# EAGLE design ivo_B_v1_1 (EAGLE 9.6.2)

## Sheet 1 of 4: Audio I/O
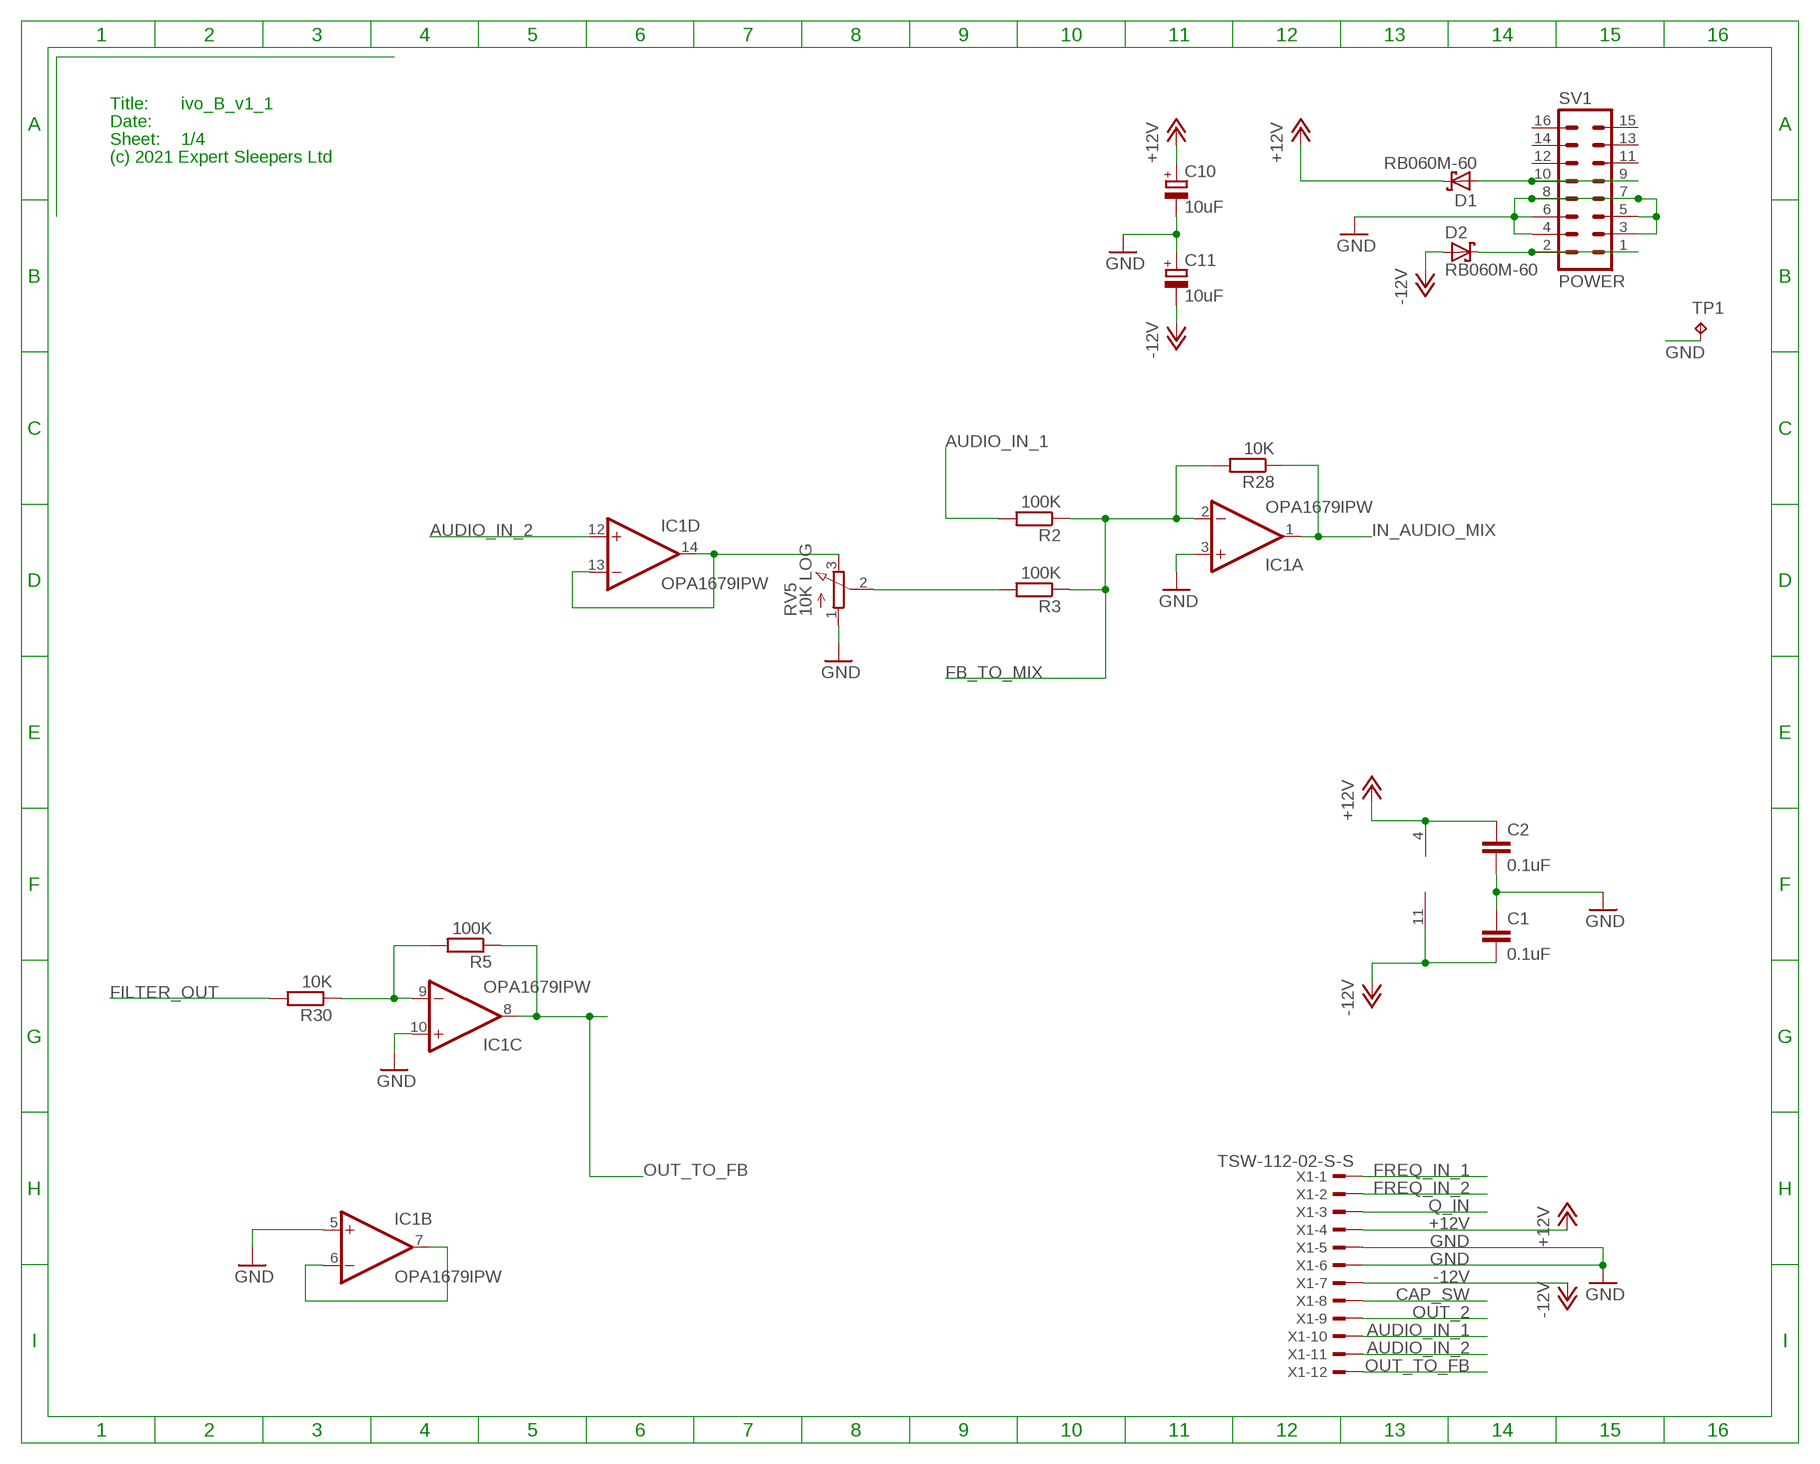
[diagram p0: schematic, sheet 1]

### Parts
C1  0.1uF  C-EUC0402  [C0402]
C2  0.1uF  C-EUC0402  [C0402]
C10  10uF  CPOL-EUUD-4X5,8  [UD-4X5,8_NICHICON]
C11  10uF  CPOL-EUUD-4X5,8  [UD-4X5,8_NICHICON]
D1  RB060M-60  [SOD123FL]
D2  RB060M-60  [SOD123FL]
IC1  OPA1679IPW  TL074PW  [PW_R-PDSO-G14]
R2  100K  R-EU_R0603  [R0603]
R3  100K  R-EU_R0603  [R0603]
R5  100K  R-EU_R0603  [R0603]
R28  10K  R-EU_R0603  [R0603]
R30  10K  R-EU_R0603  [R0603]
RV5  10K LOG  RD1610NOA0X  [RD1610NOA0X]
SV1  POWER  ML16  [ML16]
TP1  RA2  TPPAD1-13  [P1-13]
X1  TSW-112-02-S-S  [TSW-112-02-S-S]

### Nets
+12V: C2.1 C10.+ D1.C IC1.4(P:V+) X1.4 ; also sheet 2,3,4
-12V: C1.2 C11.- D2.A IC1.11(P:V-) X1.7 ; also sheet 2,3,4
AUDIO_IN_1: R2.2 X1.10
AUDIO_IN_2: IC1.12(D:+IN) X1.11
CAP_SW: X1.8 ; also sheet 4
FB_TO_MIX: IC1.2(A:-IN) R2.1 R3.1 R28.2 ; also sheet 2
FILTER_OUT: R30.2 ; also sheet 4
FREQ_IN_1: X1.1 ; also sheet 3
FREQ_IN_2: X1.2 ; also sheet 3
GND [power]: C1.1 C2.2 C10.- C11.+ IC1.3(A:+IN) IC1.5(B:+IN) IC1.10(C:+IN) RV5.1(A) SV1.3 SV1.4 SV1.5 SV1.6 SV1.7 SV1.8 TP1.TP X1.5 X1.6 ; also sheet 2,3,4
IN_AUDIO_MIX: IC1.1(A:OUT) R28.1 ; also sheet 4
N$1: D2.C SV1.1 SV1.2
N$3: IC1.6(B:-IN) IC1.7(B:OUT)
N$5: IC1.9(C:-IN) R5.2 R30.1
N$7: IC1.13(D:-IN) IC1.14(D:OUT) RV5.3(E)
N$10: R3.2 RV5.2(S)
N$15: D1.A SV1.9 SV1.10
OUT_2: X1.9 ; also sheet 4
OUT_TO_FB: IC1.8(C:OUT) R5.1 X1.12 ; also sheet 2
Q_IN: X1.3 ; also sheet 2
Unconnected: SV1.11 SV1.12 SV1.13 SV1.14 SV1.15 SV1.16

### Notes on the sheet
- Title:
- Date:
- Sheet:
- (c) 2021 Expert Sleepers Ltd

## Sheet 2 of 4: Feedback
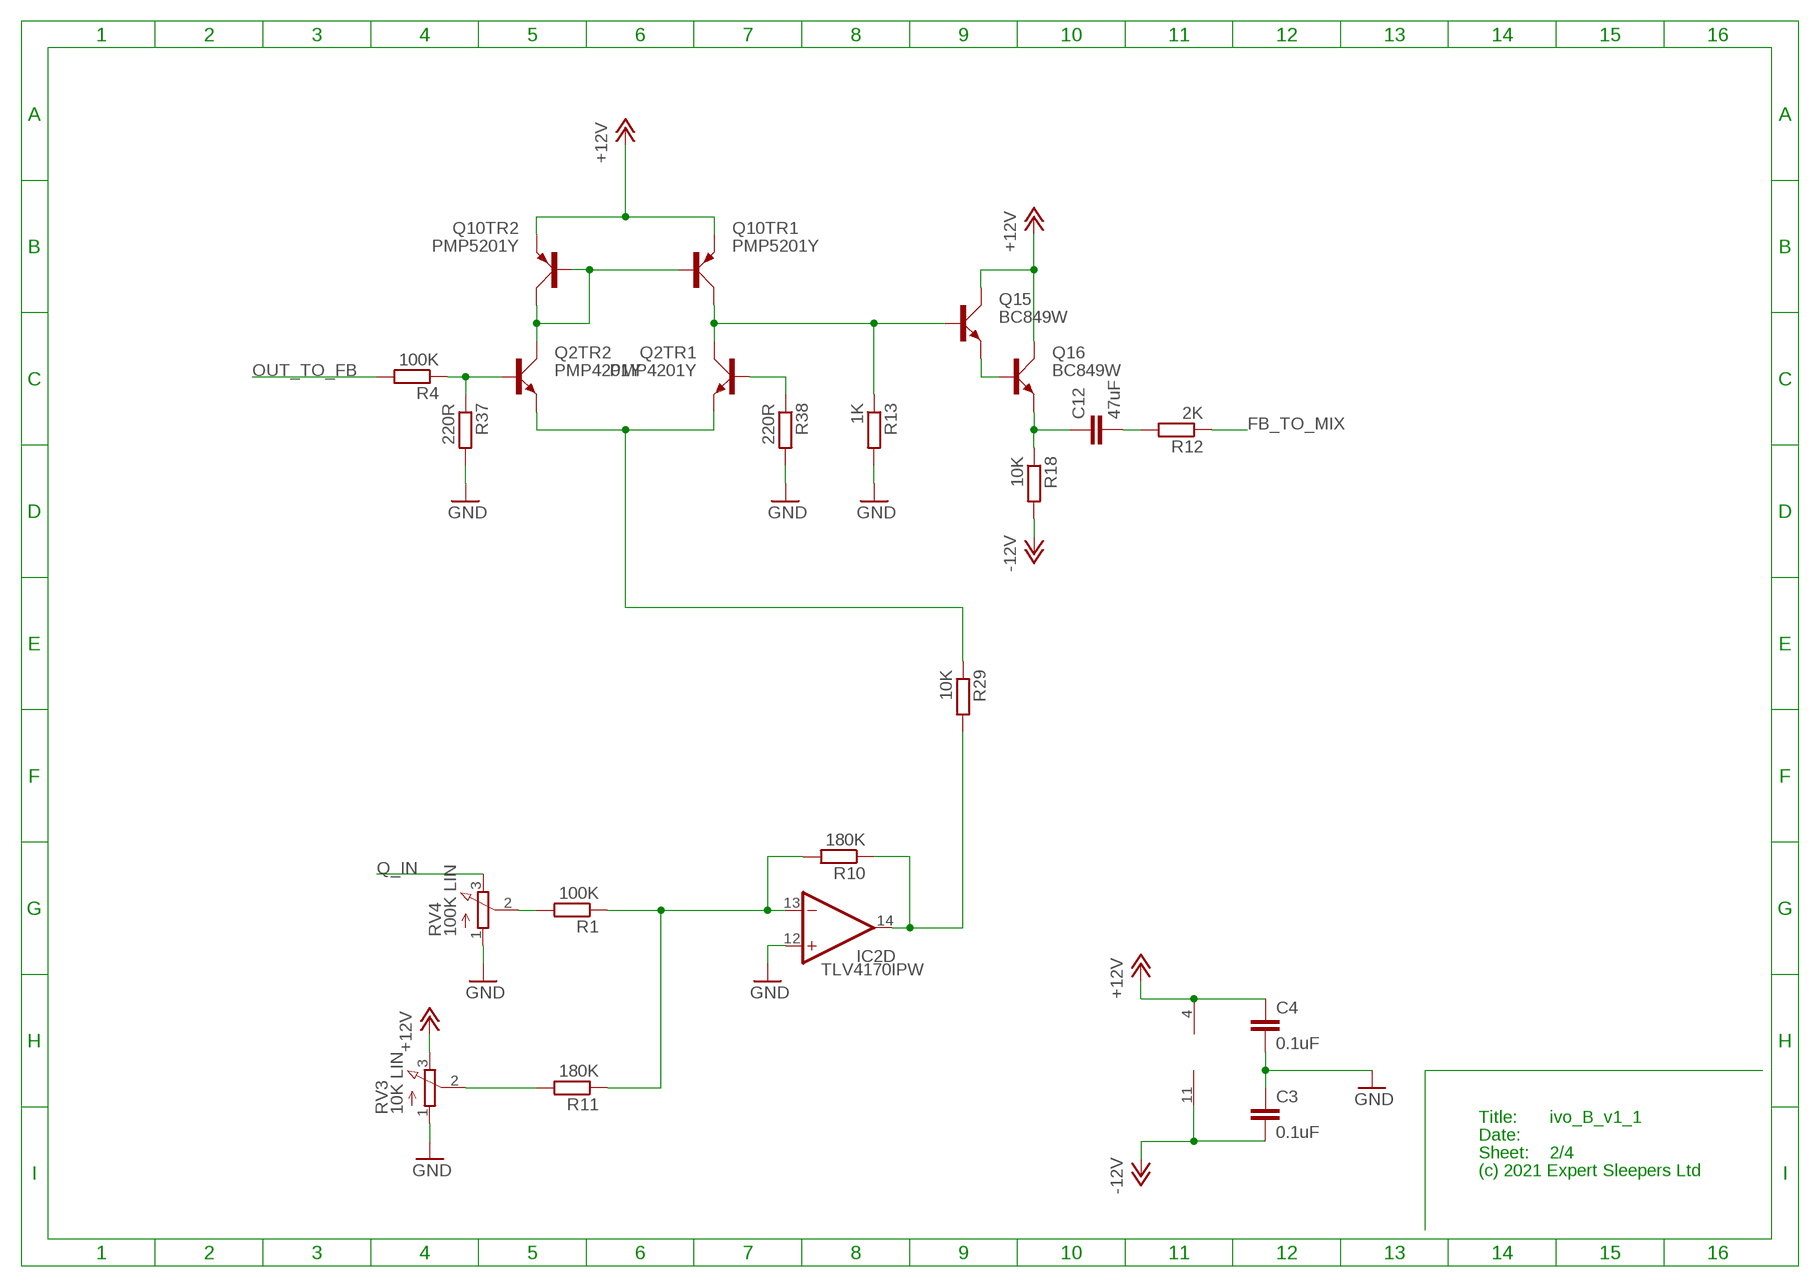
[diagram p1: schematic, sheet 2]

### Parts
C3  0.1uF  C-EUC0402  [C0402]
C4  0.1uF  C-EUC0402  [C0402]
C12  47uF  C-EUC1206  [C1206]
IC2  TLV4170IPW  TL074PW  [PW_R-PDSO-G14]
Q2  PMP4201Y  [SOT65P210X110-6N]
Q10  PMP5201Y  [SOT65P210X110-6N]
Q15  BC849W  [SOT323]
Q16  BC849W  [SOT323]
R1  100K  R-EU_R0603  [R0603]
R4  100K  R-EU_R0603  [R0603]
R10  180K  R-EU_R0603  [R0603]
R11  180K  R-EU_R0603  [R0603]
R12  2K  R-EU_R0603  [R0603]
R13  1K  R-EU_R0603  [R0603]
R18  10K  R-EU_R0603  [R0603]
R29  10K  R-EU_R0603  [R0603]
R37  220R  R-EU_R0603  [R0603]
R38  220R  R-EU_R0603  [R0603]
RV3  10K LIN  RD1610NOA0X  [RD1610NOA0X]
RV4  100K LIN  RD1610NOA0X  [RD1610NOA0X]

### Nets
+12V: C4.1 IC2.4(P:V+) Q10.4(TR2:E) Q10.5(TR1:E) Q15.3(C) Q16.3(C) RV3.3(E) ; also sheet 1,3,4
-12V: C3.2 IC2.11(P:V-) R18.2 ; also sheet 1,3,4
FB_TO_MIX: R12.1 ; also sheet 1
GND [power]: C3.1 C4.2 IC2.12(D:+IN) R13.2 R37.2 R38.2 RV3.1(A) RV4.1(A) ; also sheet 1,3,4
N$9: R1.2 RV4.2(S)
N$12: R11.2 RV3.2(S)
N$14: IC2.13(D:-IN) R1.1 R10.2 R11.1
N$18: IC2.14(D:OUT) R10.1 R29.2
N$21: C12.2 R12.2
N$24: Q2.2(TR2:B) R4.1 R37.1
N$26: Q2.4(TR2:E) Q2.5(TR1:E) R29.1
N$27: C12.1 Q16.2(E) R18.1
N$28: Q2.3(TR2:C) Q10.1(TR1:B) Q10.2(TR2:B) Q10.3(TR2:C)
N$31: Q2.6(TR1:C) Q10.6(TR1:C) Q15.1(B) R13.1
N$32: Q2.1(TR1:B) R38.1
N$34: Q15.2(E) Q16.1(B)
OUT_TO_FB: R4.2 ; also sheet 1
Q_IN: RV4.3(E) ; also sheet 1

### Notes on the sheet
- Title:
- Date:
- Sheet:
- (c) 2021 Expert Sleepers Ltd

## Sheet 3 of 4: Frequency control
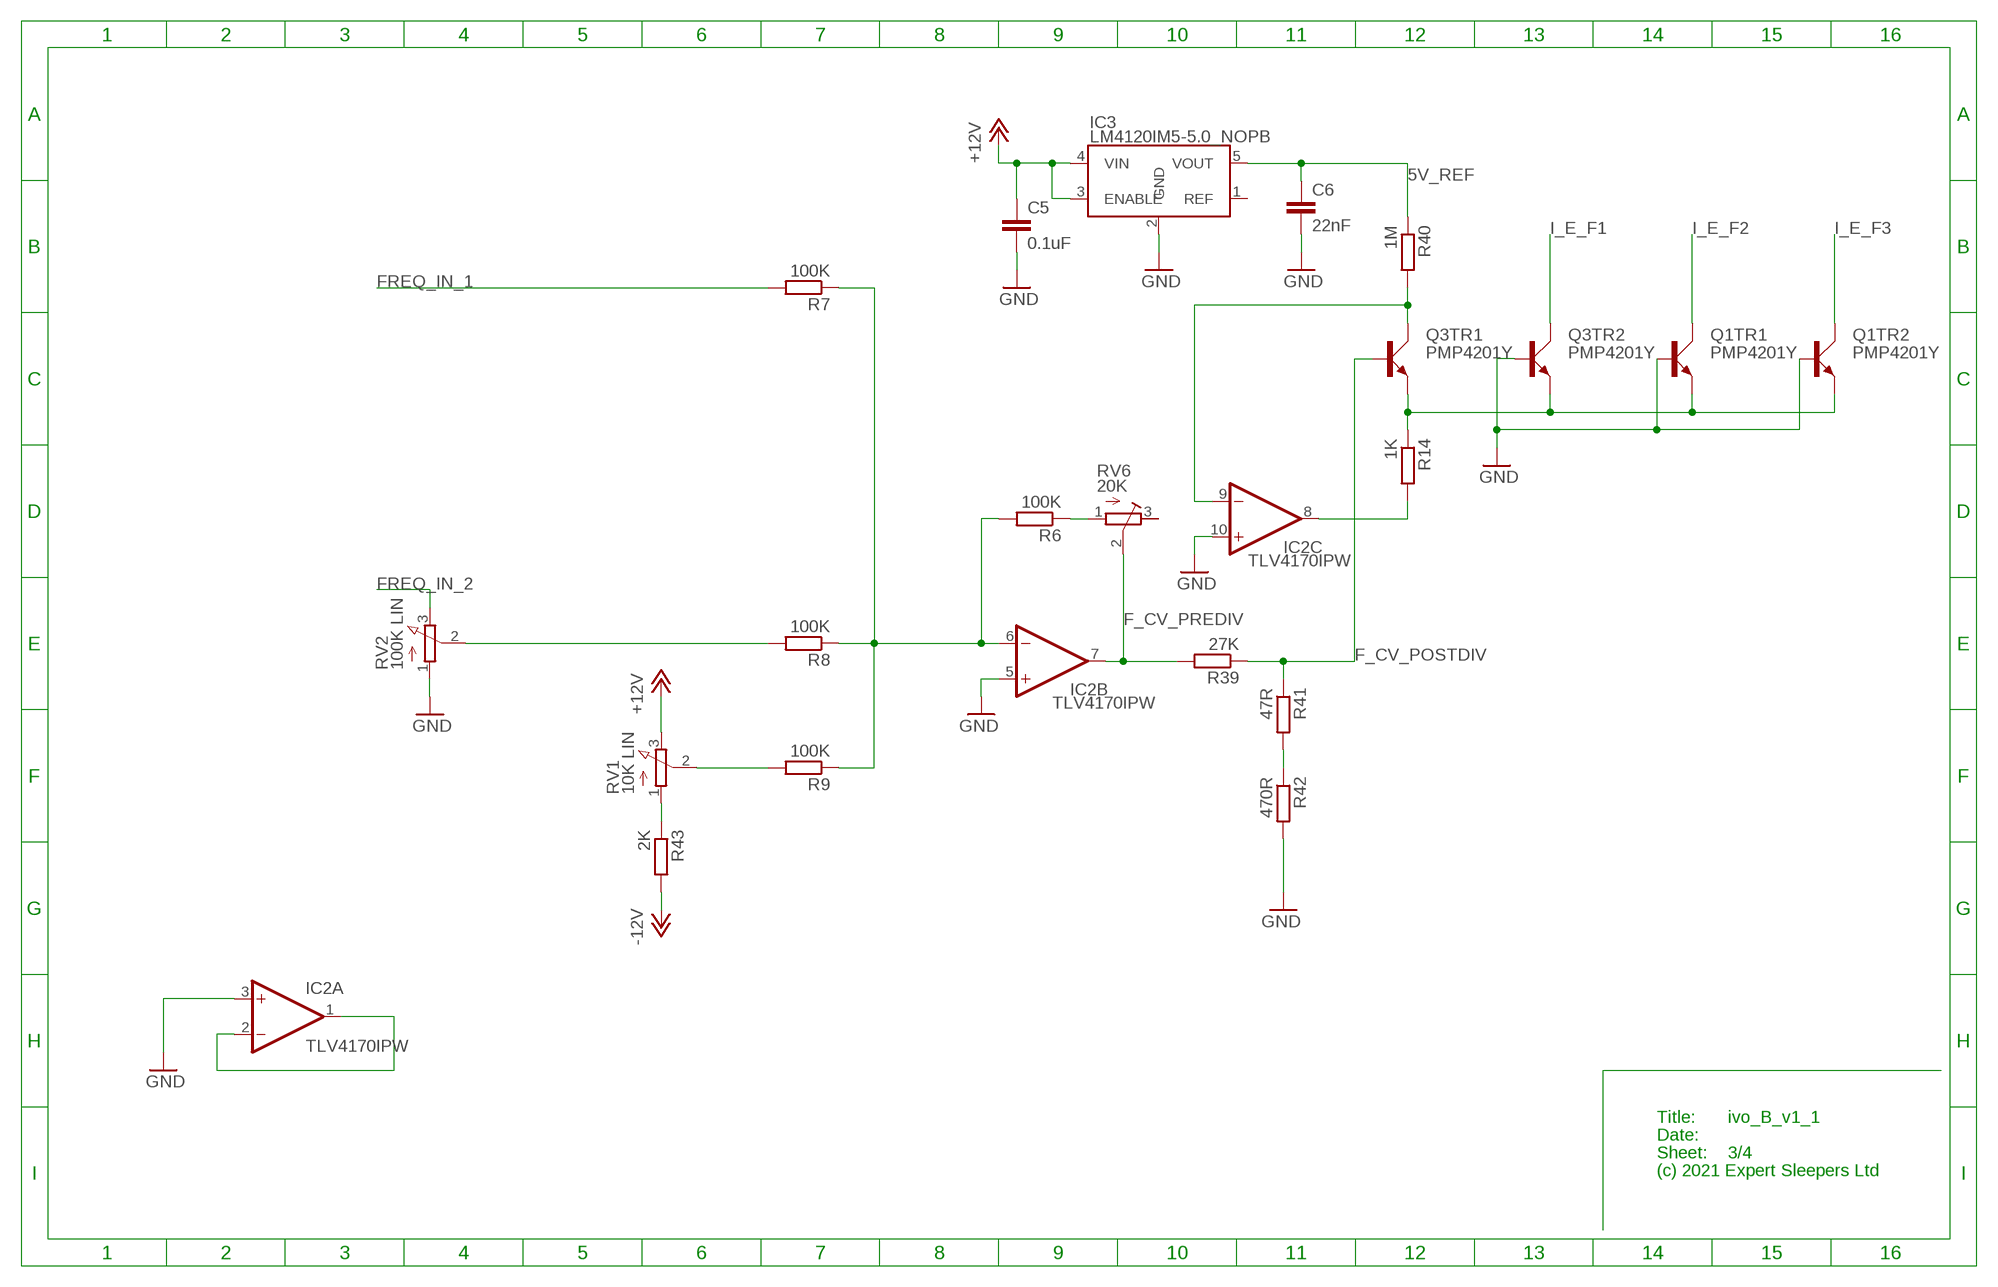
[diagram p2: schematic, sheet 3]

### Parts
C5  0.1uF  C-EUC0402  [C0402]
C6  22nF  C-EUC0402  [C0402]
IC3  LM4120IM5-5.0_NOPB  [SOT95P280X145-5N]
Q1  PMP4201Y  [SOT65P210X110-6N]
Q3  PMP4201Y  [SOT65P210X110-6N]
R6  100K  R-EU_R0603  [R0603]
R7  100K  R-EU_R0603  [R0603]
R8  100K  R-EU_R0603  [R0603]
R9  100K  R-EU_R0603  [R0603]
R14  1K  R-EU_R0603  [R0603]
R39  27K  R-EU_R0603  [R0603]
R40  1M  R-EU_R0603  [R0603]
R41  47R  R-EU_R0603  [R0603]
R42  470R  R-EU_R1206  [R1206]
R43  2K  R-EU_R0603  [R0603]
RV1  10K LIN  RD1610NOA0X  [RD1610NOA0X]
RV2  100K LIN  RD1610NOA0X  [RD1610NOA0X]
RV6  20K  TC33X  [TC33X]

### Nets
5V_REF: C6.1 IC3.5(VOUT) R40.1
+12V: C5.1 IC3.3(ENABLE) IC3.4(VIN) RV1.3(E) ; also sheet 1,2,4
-12V: R43.2 ; also sheet 1,2,4
F_CV_POSTDIV: Q3.1(TR1:B) R39.1 R41.1
F_CV_PREDIV: IC2.7(B:OUT) R39.2 RV6.2(S)
FREQ_IN_1: R7.2 ; also sheet 1
FREQ_IN_2: RV2.3(E) ; also sheet 1
GND [power]: C5.2 C6.2 IC2.3(A:+IN) IC2.5(B:+IN) IC2.10(C:+IN) IC3.2(GND) Q1.1(TR1:B) Q1.2(TR2:B) Q3.2(TR2:B) R42.2 RV2.1(A) ; also sheet 1,2,4
I_E_F1: Q3.3(TR2:C) ; also sheet 4
I_E_F2: Q1.6(TR1:C) ; also sheet 4
I_E_F3: Q1.3(TR2:C) ; also sheet 4
N$2: R43.1 RV1.1(A)
N$4: R6.1 RV6.1(A)
N$13: IC2.6(B:-IN) R6.2 R7.1 R8.1 R9.1
N$23: IC2.1(A:OUT) IC2.2(A:-IN)
N$36: R8.2 RV2.2(S)
N$37: R9.2 RV1.2(S)
N$38: R41.2 R42.1
N$45: Q1.4(TR2:E) Q1.5(TR1:E) Q3.4(TR2:E) Q3.5(TR1:E) R14.1
N$46: IC2.9(C:-IN) Q3.6(TR1:C) R40.2
N$48: IC2.8(C:OUT) R14.2
Unconnected: IC3.1(REF) RV6.3(E)

### Notes on the sheet
- Title:
- Date:
- Sheet:
- (c) 2021 Expert Sleepers Ltd

## Sheet 4 of 4: Filter core
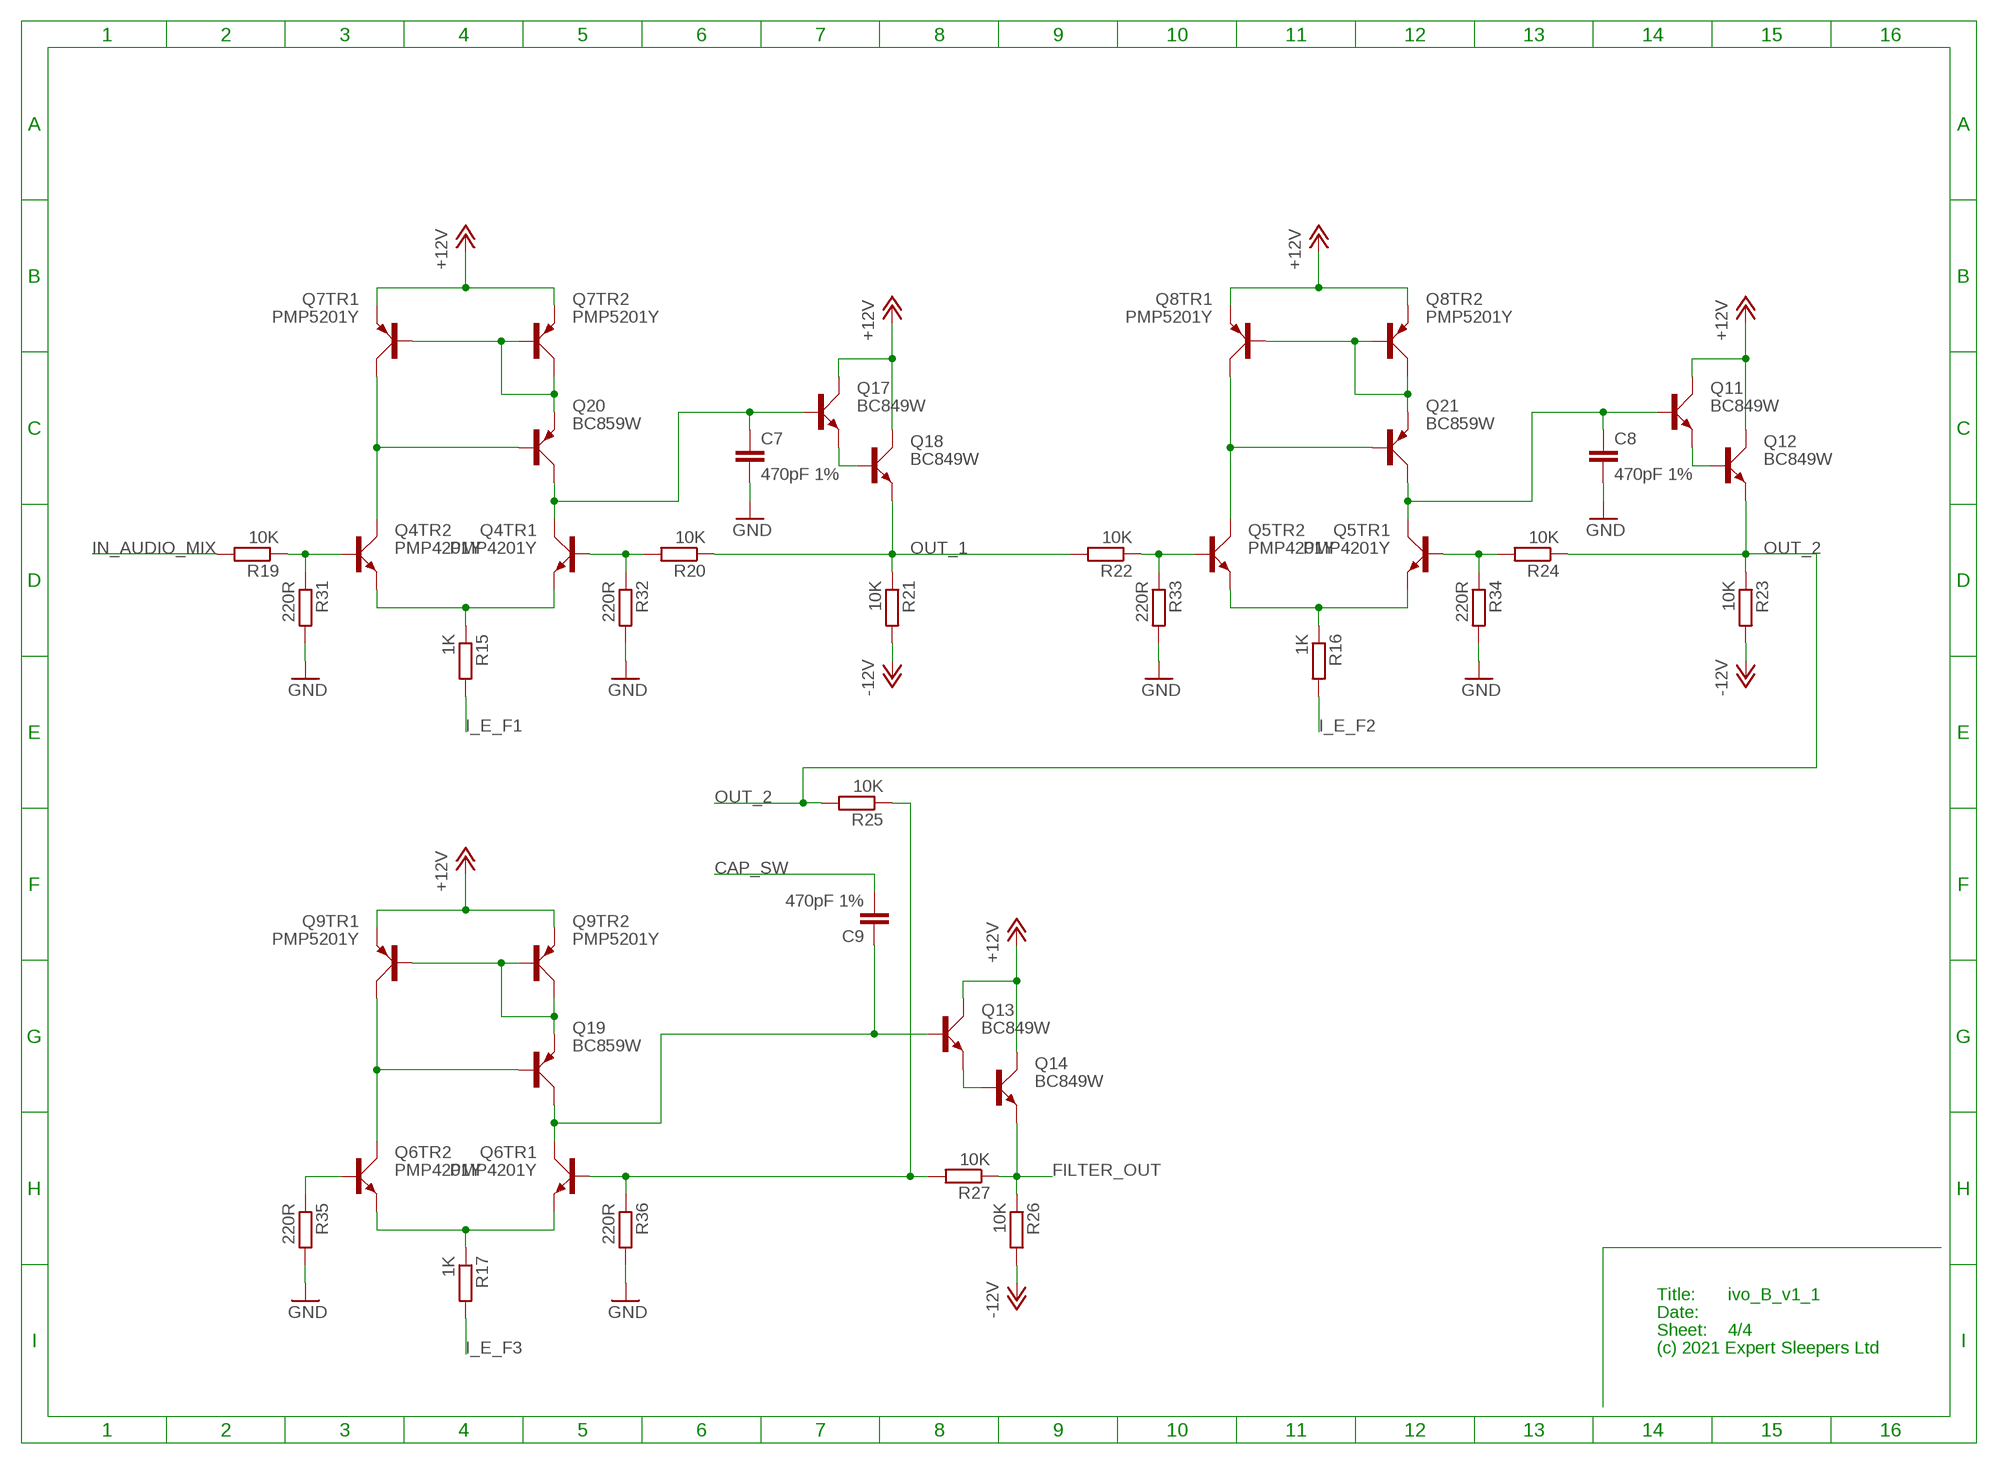
[diagram p3: schematic, sheet 4]

### Parts
C7  470pF 1%  C-EUC0603  [C0603]
C8  470pF 1%  C-EUC0603  [C0603]
C9  470pF 1%  C-EUC0603  [C0603]
Q4  PMP4201Y  [SOT65P210X110-6N]
Q5  PMP4201Y  [SOT65P210X110-6N]
Q6  PMP4201Y  [SOT65P210X110-6N]
Q7  PMP5201Y  [SOT65P210X110-6N]
Q8  PMP5201Y  [SOT65P210X110-6N]
Q9  PMP5201Y  [SOT65P210X110-6N]
Q11  BC849W  [SOT323]
Q12  BC849W  [SOT323]
Q13  BC849W  [SOT323]
Q14  BC849W  [SOT323]
Q17  BC849W  [SOT323]
Q18  BC849W  [SOT323]
Q19  BC859W  [SOT323]
Q20  BC859W  [SOT323]
Q21  BC859W  [SOT323]
R15  1K  R-EU_R0603  [R0603]
R16  1K  R-EU_R0603  [R0603]
R17  1K  R-EU_R0603  [R0603]
R19  10K  R-EU_R0603  [R0603]
R20  10K  R-EU_R0603  [R0603]
R21  10K  R-EU_R0603  [R0603]
R22  10K  R-EU_R0603  [R0603]
R23  10K  R-EU_R0603  [R0603]
R24  10K  R-EU_R0603  [R0603]
R25  10K  R-EU_R0603  [R0603]
R26  10K  R-EU_R0603  [R0603]
R27  10K  R-EU_R0603  [R0603]
R31  220R  R-EU_R0603  [R0603]
R32  220R  R-EU_R0603  [R0603]
R33  220R  R-EU_R0603  [R0603]
R34  220R  R-EU_R0603  [R0603]
R35  220R  R-EU_R0603  [R0603]
R36  220R  R-EU_R0603  [R0603]

### Nets
+12V: Q7.4(TR2:E) Q7.5(TR1:E) Q8.4(TR2:E) Q8.5(TR1:E) Q9.4(TR2:E) Q9.5(TR1:E) Q11.3(C) Q12.3(C) Q13.3(C) Q14.3(C) Q17.3(C) Q18.3(C) ; also sheet 1,2,3
-12V: R21.2 R23.2 R26.2 ; also sheet 1,2,3
CAP_SW: C9.2 ; also sheet 1
FILTER_OUT: Q14.2(E) R26.1 R27.1 ; also sheet 1
GND [power]: C7.2 C8.2 R31.2 R32.2 R33.2 R34.2 R35.2 R36.2 ; also sheet 1,2,3
I_E_F1: R15.2 ; also sheet 3
I_E_F2: R16.2 ; also sheet 3
I_E_F3: R17.2 ; also sheet 3
IN_AUDIO_MIX: R19.2 ; also sheet 1
N$20: Q4.2(TR2:B) R19.1 R31.1
N$39: Q4.4(TR2:E) Q4.5(TR1:E) R15.1
N$53: C7.1 Q4.6(TR1:C) Q17.1(B) Q20.3(C)
N$54: Q4.3(TR2:C) Q7.6(TR1:C) Q20.1(B)
N$55: Q4.1(TR1:B) R20.2 R32.1
N$56: Q17.2(E) Q18.1(B)
N$57: Q7.1(TR1:B) Q7.2(TR2:B) Q7.3(TR2:C) Q20.2(E)
N$59: Q5.2(TR2:B) R22.1 R33.1
N$60: Q5.4(TR2:E) Q5.5(TR1:E) R16.1
N$64: C8.1 Q5.6(TR1:C) Q11.1(B) Q21.3(C)
N$67: Q5.1(TR1:B) R24.2 R34.1
N$70: Q11.2(E) Q12.1(B)
N$77: Q5.3(TR2:C) Q8.6(TR1:C) Q21.1(B)
N$78: Q8.1(TR1:B) Q8.2(TR2:B) Q8.3(TR2:C) Q21.2(E)
N$79: Q6.2(TR2:B) R35.1
N$80: Q6.4(TR2:E) Q6.5(TR1:E) R17.1
N$82: C9.1 Q6.6(TR1:C) Q13.1(B) Q19.3(C)
N$83: Q6.1(TR1:B) R25.1 R27.2 R36.1
N$84: Q13.2(E) Q14.1(B)
N$85: Q6.3(TR2:C) Q9.6(TR1:C) Q19.1(B)
N$86: Q9.1(TR1:B) Q9.2(TR2:B) Q9.3(TR2:C) Q19.2(E)
OUT_1: Q18.2(E) R20.1 R21.1 R22.2
OUT_2: Q12.2(E) R23.1 R24.1 R25.2 ; also sheet 1

### Notes on the sheet
- Title:
- Date:
- Sheet:
- (c) 2021 Expert Sleepers Ltd

## Library data of the parts
C1-C9 C12 = rcl:C-EU: CAPACITOR, European symbol
C10 C11 = rcl:CPOL-EU: POLARIZED CAPACITOR, European symbol
D1 D2 = rohm2:RB060M-60: Schottky Barrier Diode
IC1 IC2 = digital-audio:TL074: OP AMP
IC3 = SamacSys_Parts:LM4120IM5-5.0_NOPB: 0.2% 50ppm/C Drift Precision Series Voltage Reference with Shutdown Enable Source: Datasheet; ARROW_PART_NUMBER: LM4120IM5-5.0/NOPB; ARROW_PRICE-STOCK: https://www.arrow.com/en/products/lm4120im5-5.0nopb/texas-instruments; DESCRIPTION: 0.2% 50ppm/C Drift Precision Series Voltage Reference with Shutdown Enable; HEIGHT: 1.45mm; MANUFACTURER_NAME: Texas Instruments; MANUFACTURER_PART_NUMBER: LM4120IM5-5.0/NOPB; MOUSER_PART_NUMBER: 926-LM4120IM550NOPB; MOUSER_PRICE-STOCK: https://www.mouser.co.uk/ProductDetail/Texas-Instruments/LM4120IM5-50-NOPB?qs=QbsRYf82W3GnvXCg2jf3mg%3D%3D
Q1-Q6 = SamacSys_Parts:PMP4201Y: Bipolar Transistors - BJT MATCHED PAIR Source: Datasheet; ARROW_PART_NUMBER: PMP4201Y,135; ARROW_PRICE-STOCK: https://www.arrow.com/en/products/pmp4201y135/nexperia; DESCRIPTION: Bipolar Transistors - BJT MATCHED PAIR; HEIGHT: 1.1mm; MANUFACTURER_NAME: Nexperia; MANUFACTURER_PART_NUMBER: PMP4201Y,135; MOUSER_PART_NUMBER: 771-PMP4201Y135; MOUSER_PRICE-STOCK: https://www.mouser.co.uk/ProductDetail/Nexperia/PMP4201Y135?qs=LOCUfHb8d9uqwNS3d98RHQ%3D%3D
Q7-Q10 = SamacSys_Parts:PMP5201Y: Bipolar Transistors - BJT MATCHED PAIR Source: Datasheet; ARROW_PART_NUMBER: PMP5201Y,135; ARROW_PRICE-STOCK: https://www.arrow.com/en/products/pmp5201y135/nexperia; DESCRIPTION: Bipolar Transistors - BJT MATCHED PAIR; HEIGHT: 1.1mm; MANUFACTURER_NAME: Nexperia; MANUFACTURER_PART_NUMBER: PMP5201Y,135; MOUSER_PART_NUMBER: 771-PMP5201Y135; MOUSER_PRICE-STOCK: https://www.mouser.co.uk/ProductDetail/Nexperia/PMP5201Y135?qs=LOCUfHb8d9vvvsx1DGNhtA%3D%3D
Q11-Q18 = NXP:BC849W
Q19-Q21 = NXP:BC859W
R1-R43 = rcl:R-EU_: RESISTOR, European symbol
RV1-RV5 = soundwell:RD1610NOA0X: 16mm Potentiometer one level Source: http://www.alphapotentiometers.net/html/16mm_pot_2.html
RV6 = bourns:TC33X
SV1 = digital-audio:ML16: MULTICOMP - MC9A12-1634
TP1 = testpad:TP: Test pad
X1 = con-samtec:TSW-112-02-S-S: THROUGH-HOLE .025" SQ POST HEADER Source: Samtec TSW.pdf; OC_FARNELL: unknown; OC_NEWARK: unknown

## Board
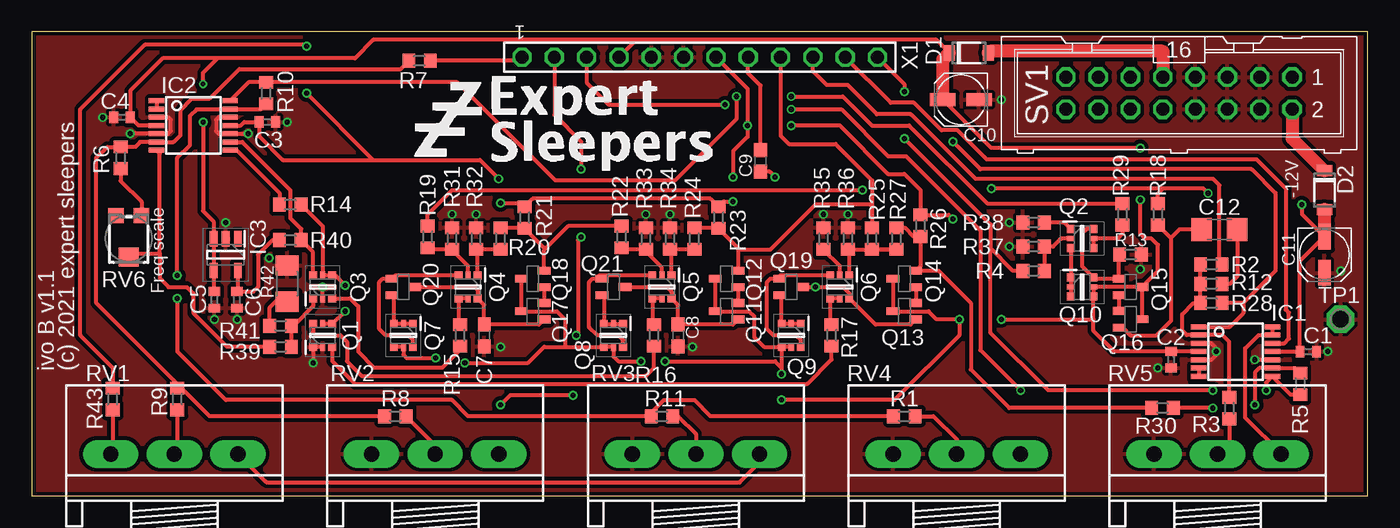
[diagram p4: board, top side]
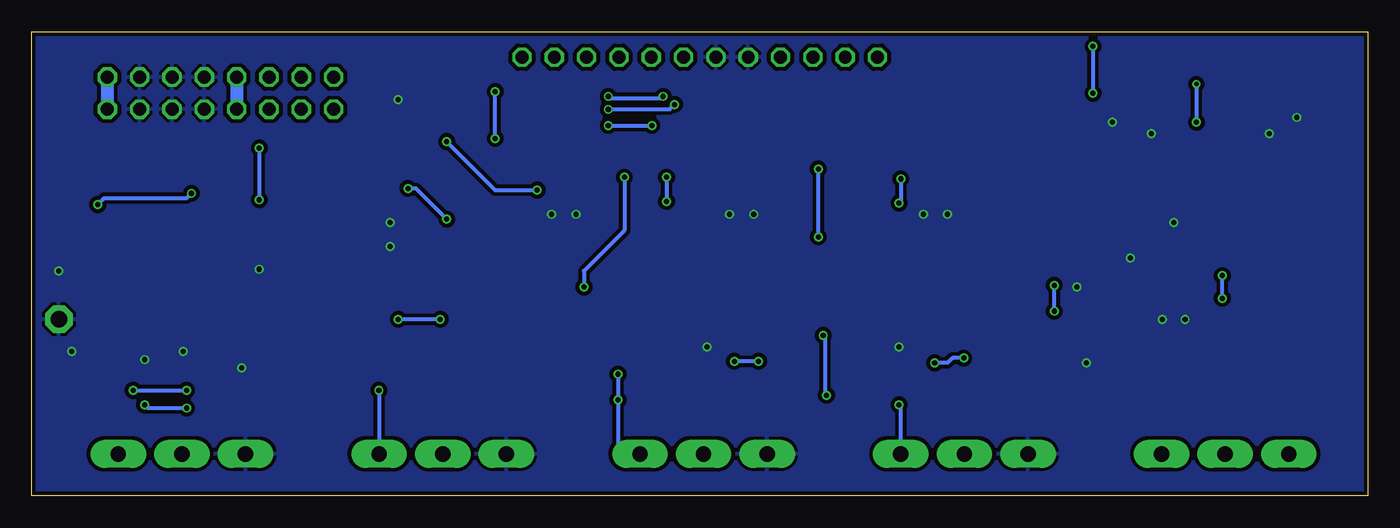
[diagram p5: board, bottom side, seen from below]

Size 105 x 36.5 mm. Coordinates in mm from the lower left corner, seen from the top.
Outline: 0,0 105,0 105,36.5 0,36.5 0,0
Copper layers (1*16): Top 0.035mm / dielectric 1.5mm / Bottom 0.035mm
Design rules "pcbtrain *": minimum track width 0.125mm, minimum drill 0.3mm, track to track 0.125mm, track to pad 0.125mm, pad to pad 0.125mm, via to via 0.125mm, smd to smd 0.125mm, copper to edge 0.25mm, drill to drill 8mil, minimum pad ring 0.15mm, minimum via ring 0.15mm, stop-mask expansion 4mil, vias tented up to drill 0mil, thermal gap 10mil

### Footprints (pad centres in the part's own frame; a part is rotated, then mirrored left to right if it is on the bottom)
C0402 = smd 0.7 x 0.9: 1 -0.65,0; 2 0.65,0
C0603 = smd 1.1 x 1: 1 -0.85,0; 2 0.85,0
UD-4X5,8_NICHICON = smd 2 x 1: + 1.425,0; - -1.425,0
C1206 = smd 1.6 x 1.8: 1 -1.4,0; 2 1.4,0
SOD123FL = smd 0.85 x 1.2: A 1.525,0; C -1.525,0
PW_R-PDSO-G14 = smd 0.4 x 1.2: 1 -1.95,-2.9; 2 -1.3,-2.9; 3 -0.65,-2.9; 4 0,-2.9; 5 0.65,-2.9; 6 1.3,-2.9; 7 1.95,-2.9; 8 1.95,2.9; 9 1.3,2.9; 10 0.65,2.9; 11 0,2.9; 12 -0.65,2.9; 13 -1.3,2.9; 14 -1.95,2.9
SOT95P280X145-5N = smd 1.2 x 0.6: 1 -1.25,0.95; 2 -1.25,0; 3 -1.25,-0.95; 4 1.25,-0.95; 5 1.25,0.95
SOT65P210X110-6N = smd 0.6 x 0.6: 1 -0.9,0.75; 3 -0.9,-0.75; 4 0.9,-0.75; 6 0.9,0.75 | smd 0.6 x 0.4: 2 -0.9,0; 5 0.9,0
SOT323 = smd 0.6 x 1: 1 -0.65,-0.9; 2 0.65,-0.9; 3 0,0.9
R0603 = smd 1 x 1.1: 1 -0.85,0; 2 0.85,0
R1206 = smd 1.6 x 1.803: 1 -1.422,0; 2 1.422,0
RD1610NOA0X = drill 1.2 pad 2.184 long: 1 -5,3.8; 2 0,3.8; 3 5,3.8
TC33X = smd 1.2 x 1.2: 1 -1,-1.8; 3 1,-1.8 | smd 1.6 x 1.5: 2 0,1.45
ML16 = drill 1.016 octagon: 1 -8.89,-1.27; 2 -8.89,1.27; 3 -6.35,-1.27; 4 -6.35,1.27; 5 -3.81,-1.27; 6 -3.81,1.27; 7 -1.27,-1.27; 8 -1.27,1.27; 9 1.27,-1.27; 10 1.27,1.27; 11 3.81,-1.27; 12 3.81,1.27; 13 6.35,-1.27; 14 6.35,1.27; 15 8.89,-1.27; 16 8.89,1.27
P1-13 = drill 1.321 pad 2.159 octagon: TP 0,0
TSW-112-02-S-S = drill 1 pad 1.5 octagon: 1 13.97,0; 2 11.43,0; 3 8.89,0; 4 6.35,0; 5 3.81,0; 6 1.27,0; 7 -1.27,0; 8 -3.81,0; 9 -6.35,0; 10 -8.89,0; 11 -11.43,0; 12 -13.97,0

### Placement (x,y rotation side)
C1  100.33,11.35 180 top
C2  89.53,10.71 270 top
C3  18.52,29.4 180 top
C4  7.08,29.78 180 top
C5  14.35,15.41 270 top
C6  16.13,15.41 270 top
C7  35.56,12.62 270 top
C8  50.8,12.62 270 top
C9  57.28,26.34 90 top
C10  73.03,31.16 180 top
C11  101.6,18.97 270 top
C12  93.34,20.95 0 top
D1  73.66,34.84 0 top
D2  101.6,24.05 270 top
IC1  94.61,11.35 270 top
IC2  12.7,29.13 270 top
IC3  15.24,18.97 270 top
Q1  22.86,12.62 90 top
Q2  82.55,20.24 0 top
Q3  22.86,16.43 90 top
Q4  34.29,16.43 270 top
Q5  49.53,16.43 270 top
Q6  63.5,16.43 270 top
Q7  29.21,12.62 270 top
Q8  45.72,12.62 270 top
Q9  59.69,12.62 270 top
Q10  82.55,16.43 0 top
Q11  54.61,14.53 90 top
Q12  54.61,17.07 90 top
Q13  68.58,14.53 90 top
Q14  68.58,17.07 90 top
Q15  86.36,16.43 270 top
Q16  86.36,13.89 270 top
Q17  39.37,14.53 90 top
Q18  39.37,17.07 90 top
Q19  59.69,16.43 270 top
Q20  29.21,16.43 270 top
Q21  45.72,16.43 270 top
R1  68.58,6.27 0 top
R2  92.71,18.21 0 top
R3  94.11,6.91 270 top
R4  78.74,17.7 180 top
R5  99.69,8.81 90 top
R6  6.99,26.59 90 top
R7  30.48,34.21 0 top
R8  28.57,6.27 0 top
R9  11.43,7.62 270 top
R10  18.41,31.67 270 top
R11  49.53,6.27 0 top
R12  92.71,16.68 0 top
R13  86.36,18.97 0 top
R14  20.32,22.91 180 top
R15  33.66,12.62 270 top
R16  48.9,12.62 270 top
R17  62.87,12.62 270 top
R18  88.52,22.14 90 top
R19  31.11,20.37 90 top
R20  36.83,20.24 270 top
R21  38.73,21.89 90 top
R22  46.35,20.37 90 top
R23  53.98,21.89 90 top
R24  52.07,20.24 270 top
R25  66.04,20.24 90 top
R26  69.85,21.26 90 top
R27  67.94,20.24 270 top
R28  92.71,15.16 180 top
R29  85.72,22.14 90 top
R30  88.87,6.92 180 top
R31  33.02,20.24 90 top
R32  34.92,20.24 90 top
R33  48.26,20.24 90 top
R34  50.16,20.24 90 top
R35  62.23,20.24 90 top
R36  64.14,20.24 90 top
R37  78.74,19.61 180 top
R38  78.74,21.51 180 top
R39  19.55,11.73 180 top
R40  20.32,20.11 0 top
R41  19.55,13.38 180 top
R42  20.06,16.69 90 top
R43  6.35,7.62 90 top
RV1  11.2,-0.5 0 top
RV2  31.7,-0.5 0 top
RV3  52.2,-0.5 0 top
RV4  72.7,-0.5 0 top
RV5  93.2,-0.5 0 top
RV6  7.62,20.24 180 top
SV1  90.17,31.67 180 top
TP1  102.87,13.89 0 top
U$1  [ES_ZZZ_TEXT_TPLACE_1IN_600DPI]  29.08,25.15 0 top
X1  52.5,34.5 180 top

### Tracks (layer width: path | path; a pad name or v marks a point on that pad's centre or on a via)
5V_REF
  Top 0.305: IC3.5 16.19,16.12 C6.1 17.41,16.06 17.78,16.43 17.78,18.97 18.92,20.11 R40.1
+12V  (via drill 0.35, 0.4)
  Top 0.305: Q7.4 Q7.5 29.21,11.1 29.46,10.84 v31.75,10.84 | Q9.5 Q9.4 | C5.1 14.29,16.12 IC3.4 IC3.3 14.29,21.59 13.46,22.42 v13.46,29.38 | Q18.3 Q17.3 41.27,14.53 41.91,13.89 41.91,11.72 | Q12.3 Q11.3 56.39,14.53 56.77,14.14 56.77,12.49 57.54,11.72 Q9.4 | Q14.3 Q13.3 70.48,14.53 71.12,13.89 v72.9,13.89 72.9,12.62 67.82,7.54 v58.93,7.54 | Q15.3 Q16.3 | Q15.3 Q10.5 Q10.4 83.45,13.89 | IC1.4 89.55,11.35 C2.1 85.08,11.37 83.45,12.99 83.45,13.89 | Q9.4 58.94,10.08 | 58.94,10.08 58.94,9.58 v58.93,9.57 | Q15.3 88.52,17.69 88.52,19.73 88.01,20.24 87.5,20.24 87.12,20.62 v87.12,23.29 | v87.12,27.35 75.44,27.35 71.63,31.16 C10.+ | v76.2,13.89 83.45,13.89 | v47.88,10.59 46.1,10.59 45.72,10.97 Q8.5 Q8.4 41.91,11.72 | v49.78,10.59 58.43,10.59 58.94,10.08 | 41.91,11.72 40.27,11.72 39.01,10.46 v34.04,10.46 | RV1.3 18.39,1.11 18.47,1.06 55.63,1.06 57.2,2.64 RV3.3 | 47.51,35.86 X1.4 | 47.51,35.86 71.12,35.86 D1.C | 47.51,35.86 26.84,35.86 25.4,34.42 14.61,34.42 | 14.61,34.42 10.29,34.42 7.74,31.86 C4.1 8.38,29.13 IC2.4 | v13.46,32.38 13.46,33.27 14.61,34.42
  Top 1.016: C10.+ 71.6,34.31 D1.C
  Bottom 0.305: v58.93,9.57 v58.93,7.54 58.93,3.73 58.5,3.3 RV3.3 | v87.12,27.35 v87.12,23.29 | v72.9,13.89 v76.2,13.89 | v47.88,10.59 v49.78,10.59 | v31.75,10.84 32.64,10.84 33.02,10.46 v34.04,10.46 | v13.46,32.38 v13.46,29.38
-12V  (via drill 0.4)
  Top 0.305: IC1.11 C1.2 99.68,18.48 C11.- 99.82,22.17 v99.82,22.91 | v72.39,21.76 72.05,22.11 R26.2 69.85,24.05 68.58,25.32 67.31,25.32 63.5,29.13 v59.69,29.13 | 88.9,24.18 92.08,24.18 v92.46,23.8 | 88.9,24.18 v75.44,24.18 | v21.59,35.35 21.46,35.48 8.89,35.48 3.81,30.4 3.81,12.62 5.04,11.39 5.51,10.92 6.35,10.08 R43.2 | v36.7,24.94 35.22,26.42 26.84,26.42 | v36.83,23.03 38.44,23.03 R21.2 39.37,23.38 53.34,23.38 R23.2 54.4,23.16 v55.12,23.16 | 26.84,26.42 19.72,26.42 17.86,28.28 C3.2 16.7,29.4 16.43,29.13 IC2.11 | X1.7 56.26,32.01 v56.26,29.13 56.26,28.24 55.12,27.1 v55.12,25.07 | R18.2 88.52,23.8 88.9,24.18 | v21.59,31.67 26.84,26.42
  Top 1.016: D2.A C11.-
  Bottom 0.305: v59.69,29.13 v56.26,29.13 | v99.82,22.91 99.31,23.41 92.84,23.41 v92.46,23.8 | v72.39,21.76 74.8,24.18 v75.44,24.18 | v21.59,35.35 v21.59,31.67 | v36.7,24.94 36.7,23.16 v36.83,23.03 | v55.12,25.07 v55.12,23.16
AUDIO_IN_1
  Top 0.305: X1.10 61.39,33.4 62.48,32.3 64.14,32.3 66.42,30.02 69.09,30.02 74.17,24.94 92.84,24.94 93.34,24.43 93.34,18.46 93.56,18.25 R2.2
AUDIO_IN_2
  Top 0.305: IC1.12 98.44,12 98.81,12.37 98.81,14.4 98.55,14.65 98.55,24.18 96.27,26.46 75.06,26.46 72.77,28.75 71.5,28.75 69.33,30.92 67.51,30.92 X1.11
CAP_SW
  Top 0.305: C9.2 57.28,32.27 56.31,33.23 X1.8
F_CV_POSTDIV
  Top 0.305: Q3.1 22.11,14.92 20.57,13.38 R41.1 R39.1
F_CV_PREDIV
  Top 0.305: R39.2 15.37,11.73 12.7,14.39 12.7,15.92 12.19,16.43 10.75,16.43 10.05,17.12 10.05,19.05 | 10.05,19.05 10.05,26.93 IC2.7 | RV6.2 7.88,19.05 10.05,19.05
FB_TO_MIX
  Top 0.305: R3.1 94.11,12.11 93.57,12.65 IC1.2 90.78,12.65 90.42,13 90.42,14.27 91.31,15.16 R28.2 R12.1 R2.1
FILTER_OUT
  Top 0.305: R30.2 76.82,6.92 73.8,9.94 73.8,15.18 71.26,17.71 Q14.2 69.85,18.09 R26.1 69.3,20.41 68.62,21.09 R27.1
FREQ_IN_1
  Top 0.305: X1.1 38.24,34.21 R7.2
FREQ_IN_2  (via drill 0.4)
  Top 0.305: v43.18,20.37 42.93,20.11 42.93,12.75 v42.8,12.62 | v43.18,25.7 43.18,27.86 41.07,29.97 X1.2 | v42.55,7.92 37.59,7.92 v36.83,7.16
  Bottom 0.305: v43.18,20.37 v43.18,25.7 | RV2.3 36.7,7.03 v36.83,7.16 | v42.8,12.62 42.67,12.49 42.67,8.05 v42.55,7.92
GND  (via drill 0.4)
  Top 0.305: Q1.2 Q1.1 22.1,11.71 v22.1,10.46 | Q3.2 v22.86,16.43 | v7.75,28.5 7.76,28.48 IC2.5 10.7,28.48 10.92,28.7 10.92,29.59 10.73,29.78 IC2.3 | IC1.3 92.69,12 93.09,11.6 v93.09,11.35 93.09,11.1 92.69,10.7 IC1.5 | IC1.10 96.15,10.7 v96.14,10.71 | v17.02,28.5 17,28.48 IC2.10 14.7,28.48 14.48,28.7 14.48,29.59 14.67,29.78 IC2.12
  other vias: 36.83,11.73 34.92,22.14 33.02,22.14 48.26,22.14 50.16,22.14 51.94,11.73 64.14,22.14 62.23,22.14 15.24,21.51 16.13,13.89 14.35,13.89 101.85,11.35 88.52,10.08 87.12,17.83 102.87,17.7 76.2,31.16 76.83,19.61 76.83,21.51 20.07,29.38 5.59,29.77 18.67,18.72
  pour Top (isolate 0.305): 0,0 105,0 105,36.5 0,36.5
  pour Bottom (isolate 0.305): 0,0 105,0 105,36.5 0,36.5
I_E_F1
  Top 0.305: R15.2 33.66,11.48 32.26,10.08 26.92,10.08 25.65,11.35 25.65,14.91 25.03,15.53 Q3.3
I_E_F2
  Top 0.305: Q1.6 22.11,12.86 22.35,12.62 24.26,12.62 24.77,12.11 24.77,10.59 25.91,9.45 48.26,9.45 48.9,10.08 R16.2
I_E_F3
  Top 0.305: Q1.3 23.61,10.6 25.4,8.81 60.96,8.81 62.87,10.71 R17.2
IN_AUDIO_MIX  (via drill 0.4)
  Top 0.305: IC1.1 94.15,13.3 95.21,14.36 95.21,15.16 | 95.21,15.16 R28.1 | R19.2 31.11,22.14 33.02,24.05 v65.28,24.05 | v72.39,27.86 74.55,25.7 95.88,25.7 97.75,23.83 97.75,17.7 95.21,15.16
  Bottom 0.305: v72.39,27.86 68.58,24.05 v65.28,24.05
N$1
  Top 1.016: D2.C 99.06,28.11 SV1.2
  Bottom 1.016: SV1.1 SV1.2
N$2
  Top 0.305: R43.1 6.35,3.45 RV1.1
N$3
  Top 0.305: IC1.6 IC1.7
N$4
  Top 0.305: R6.1 6.99,24.77 8.62,23.13 RV6.1
N$5  (via drill 0.4)
  Top 0.305: R5.2 99.31,10.05 IC1.9 96.49,10.05 96.14,9.7 v96.14,7.16 | v92.84,6.91 92.82,6.92 R30.1
  Bottom 0.305: v96.14,7.16 95.89,6.91 v92.84,6.91
N$7
  Top 0.305: IC1.14 IC1.13 96.42,12.65 95.38,11.6 95.38,6.15 98.23,3.3 RV5.3
N$9
  Top 0.305: R1.2 70.87,6.27 72.7,4.44 RV4.2
N$10
  Top 0.305: R3.2 94.11,4.21 RV5.2
N$12
  Top 0.305: R11.2 50.8,6.27 52.2,4.87 RV3.2
N$13
  Top 0.305: R8.1 13.97,6.27 11.43,8.81 | R7.1 29,33.58 16.3,33.58 13.97,31.24 12.57,31.24 11.68,30.35 11.68,28.37 11.15,27.83 IC2.6 8.52,27.83 8.13,27.44 R6.2 5.93,27.44 5.08,26.59 5.08,15.16 11.43,8.81 | R9.1 11.43,8.81
N$14  (via drill 0.4)
  Top 0.305: R10.2 18.02,30.43 IC2.13 15.56,30.39 12.95,30.39 12.45,29.89 12.45,27.61 11.43,26.59 v11.43,17.32 | v11.43,15.54 11.43,11.35 15.24,7.54 33.02,7.54 34.29,6.27 R11.1 48.68,6.54 49.69,7.54 52.07,7.54 53.34,6.27 R1.1
  Bottom 0.305: v11.43,15.54 v11.43,17.32
N$15
  Top 1.016: D1.A 75.31,34.97 88.9,34.97 SV1.9
  Bottom 1.016: SV1.9 SV1.10
N$18  (via drill 0.4)
  Top 0.305: IC2.14 17.04,32.52 R10.1 33.44,32.52 41.15,24.81 50.55,24.81 55.37,29.64 v55.37,31.42 | v59.69,31.42 63.75,31.42 66.04,29.13 68.96,29.13 75.09,23 R29.2
  Bottom 0.305: v59.69,31.42 59.56,31.29 55.5,31.29 v55.37,31.42
N$20
  Top 0.305: Q4.2 34.29,18.08 33.02,19.35 R31.1 31.24,19.39 R19.1
N$21
  Top 0.305: C12.2 94.74,17.27 94.15,16.68 R12.2
N$23
  Top 0.305: IC2.1 IC2.2
N$24
  Top 0.305: Q2.2 80.9,20.24 80.26,19.61 R37.1 R4.1
N$26
  Top 0.305: Q2.4 Q2.5 85.34,20.24 85.72,20.62 R29.1
N$27
  Top 0.305: Q16.2 85.74,13.24 86.36,12.62 88.39,12.62 89.53,13.76 89.53,20.28 | R18.1 89.53,20.28 | C12.1 90.21,20.95 89.53,20.28
N$28
  Top 0.305: Q2.3 Q10.1 Q10.2 Q10.3
N$31
  Top 0.305: Q2.6 82.92,20.99 82.55,20.62 82.55,18.08 Q10.6 83.55,17.08 Q15.1 85.46,18.87 R13.1
N$32
  Top 0.305: Q2.1 81.14,21.5 80.03,21.5 80.01,21.51 R38.1
N$34
  Top 0.305: Q15.2 Q16.1
N$36
  Top 0.305: R8.2 31.7,4 RV2.2
N$37
  Top 0.305: R9.2 11.43,3.33 RV1.2
N$38
  Top 0.305: R41.2 18.7,14.81 19.49,15.6 R42.1
N$39
  Top 0.305: Q4.5 Q4.4 33.54,13.71 R15.1
N$45  (via drill 0.4)
  Top 0.305: Q1.5 Q1.4 24.61,14.53 v24.64,14.53 | v24.64,16.56 23.86,17.33 Q3.4 Q3.5 22.86,21.22 R14.1
  Bottom 0.305: v24.64,14.53 v24.64,16.56
N$46
  Top 0.305: Q3.6 22.11,19.17 R40.2 21.17,21 20.32,21.85 20.32,24.05 16.54,27.83 IC2.9
N$48
  Top 0.305: IC2.8 16.11,27.18 19.47,23.82 R14.2
N$53
  Top 0.305: Q20.3 34.8,16.43 35.05,16.18 35.05,15.54 | 35.05,15.54 Q4.6 | 35.05,15.54 35.56,15.03 C7.1 39.87,13.47 Q17.1
N$54
  Top 0.305: Q4.3 28.56,17.33 Q20.1 27.57,17.08 27.3,16.81 27.3,13.13 27.81,12.62 29.59,12.62 29.96,12.25 Q7.6
N$55
  Top 0.305: Q4.1 35.04,19.15 R32.1 R20.2
N$56
  Top 0.305: Q18.1 Q17.2
N$57
  Top 0.305: Q7.1 Q7.2 Q7.3 28.46,15.63 Q20.2
N$59
  Top 0.305: Q5.2 49.53,17.95 48.26,19.22 R33.1 46.48,19.39 R22.1
N$60
  Top 0.305: Q5.5 Q5.4 48.78,13.71 R16.1
N$64
  Top 0.305: Q21.3 49.91,16.43 50.28,16.06 Q5.6 50.8,15.01 C8.1 55.1,13.47 Q11.1
N$67
  Top 0.305: Q5.1 50.28,19.15 R34.1 R24.2
N$70
  Top 0.305: Q12.1 Q11.2
N$77
  Top 0.305: Q5.3 44.57,17.33 Q21.1 44.08,17.08 43.81,16.81 43.81,13.26 44.45,12.62 46.1,12.62 46.47,12.25 Q8.6
N$78
  Top 0.305: Q21.2 44.97,15.63 Q8.3 Q8.2 Q8.1
N$79
  Top 0.305: Q6.2 63.5,18.08 62.23,19.35 R35.1
N$80
  Top 0.305: Q6.5 Q6.4 62.75,13.71 R17.1
N$82  (via drill 0.4)
  Top 0.305: Q19.3 v61.59,16.43 63.75,16.43 64.25,15.93 Q6.6 66.31,13.47 69.08,13.47 Q13.1 | C9.1 58,25.49 v58.42,25.07
  Bottom 0.305: v58.42,25.07 58.42,20.88 61.59,17.7 v61.59,16.43
N$83
  Top 0.305: Q6.1 64.25,19.15 R36.1 R27.2 R25.1
N$84
  Top 0.305: Q14.1 Q13.2
N$85
  Top 0.305: Q6.3 58.79,17.33 Q19.1 58.05,17.08 57.78,16.81 57.78,13.13 58.29,12.62 60.07,12.62 60.44,12.25 Q9.6
N$86
  Top 0.305: Q9.1 Q9.2 Q9.3 58.94,15.63 Q19.2
OUT_1
  Top 0.305: Q18.2 40.27,19.34 | 40.27,19.34 42.15,21.22 R22.2 | R20.1 38.69,21.09 R21.1 40.27,19.51 40.27,19.34
OUT_2
  Top 0.305: 66.04,22.78 R25.2 | 66.04,22.78 65.91,22.91 61.59,22.91 58.03,19.34 55.68,19.34 55.51,19.51 | R24.1 53.93,21.09 R23.1 55.51,19.51 | 55.51,19.51 Q12.2 | X1.9 58.85,28.32 59.5,27.67 63.18,27.67 66.04,24.81 66.04,22.78
OUT_TO_FB  (via drill 0.4)
  Top 0.305: R5.1 98.95,7.96 IC1.8 97.03,8.91 v97.03,8.3 | R4.2 77.13,17.7 75.35,19.48 | 75.35,19.48 75.35,21.34 v68.58,28.11 | 75.35,19.48 75.35,12.84 79.88,8.3 v92.84,8.3 | X1.12 68.58,32.39 v68.58,31.8
  Bottom 0.305: v97.03,8.3 v92.84,8.3 | v68.58,28.11 v68.58,31.8
Q_IN  (via drill 0.4)
  Top 0.305: v77.72,8.3 74.55,11.48 74.55,20.88 68.71,26.72 67.31,26.72 63.63,30.4 v59.69,30.4 | X1.3 43.61,32.51 45.34,30.78 v54.48,30.78
  Bottom 0.305: v77.72,8.3 77.72,8.27 77.7,8.18 RV4.3 | v59.69,30.4 54.86,30.4 v54.48,30.78

### Text on the board
tPlace: -12V | Freq scale | ivo B v1.1 | (c) 2021 expert sleepers